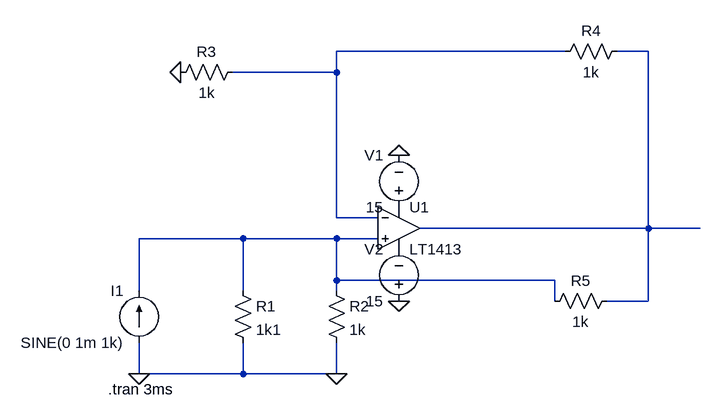
[diagram p0: schematic EXP-4_ItoV.asc]
EXP-4_ItoV.asc, the LTspice schematic file:
Version 4
SHEET 1 880 680
WIRE 480 -96 128 -96
WIRE 608 -96 560 -96
WIRE 128 -64 128 -96
WIRE 128 -64 -32 -64
WIRE 128 160 128 -64
WIRE 192 160 128 160
WIRE 608 176 608 -96
WIRE 608 176 256 176
WIRE 688 176 608 176
WIRE -16 192 -176 192
WIRE 128 192 -16 192
WIRE 192 192 128 192
WIRE 128 256 128 192
WIRE 464 256 128 256
WIRE -176 272 -176 192
WIRE -16 272 -16 192
WIRE 128 272 128 256
WIRE 464 288 464 256
WIRE 608 288 608 176
WIRE 608 288 544 288
WIRE -176 400 -176 352
WIRE -16 400 -16 352
WIRE -16 400 -176 400
WIRE 128 400 128 352
WIRE 128 400 -16 400
FLAG -176 400 0
FLAG 128 400 0
FLAG -112 -64 0
FLAG 224 64 0
FLAG 224 288 0
SYMBOL current -176 352 R180
WINDOW 0 24 80 Left 2
WINDOW 3 24 0 Left 2
WINDOW 123 0 0 Left 0
WINDOW 39 0 0 Left 0
SYMATTR InstName I1
SYMATTR Value SINE(0 1m 1k)
SYMBOL res -32 256 R0
SYMATTR InstName R1
SYMATTR Value 1k1
SYMBOL res 112 256 R0
SYMATTR InstName R2
SYMATTR Value 1k
SYMBOL res -16 -80 R90
WINDOW 0 0 56 VBottom 2
WINDOW 3 32 56 VTop 2
SYMATTR InstName R3
SYMATTR Value 1k
SYMBOL res 576 -112 R90
WINDOW 0 0 56 VBottom 2
WINDOW 3 32 56 VTop 2
SYMATTR InstName R4
SYMATTR Value 1k
SYMBOL res 560 272 R90
WINDOW 0 0 56 VBottom 2
WINDOW 3 32 56 VTop 2
SYMATTR InstName R5
SYMATTR Value 1k
SYMBOL OpAmps\\LT1413 224 112 R0
SYMATTR InstName U1
SYMBOL voltage 224 160 R180
WINDOW 0 24 96 Left 2
WINDOW 3 24 16 Left 2
WINDOW 123 0 0 Left 0
WINDOW 39 0 0 Left 0
SYMATTR InstName V1
SYMATTR Value 15
SYMBOL voltage 224 304 R180
WINDOW 0 24 96 Left 2
WINDOW 3 24 16 Left 2
WINDOW 123 0 0 Left 0
WINDOW 39 0 0 Left 0
SYMATTR InstName V2
SYMATTR Value 15
TEXT -224 424 Left 2 !.tran 3ms

The netlist it stands for:
* EXP-4_ItoV.asc
I1 0 N003 SINE(0 1m 1k)
R1 N003 0 1k1
R2 N003 0 1k
R3 N001 0 1k
R4 N002 N001 1k
R5 N002 N003 1k
XU1 N003 N001 P001 P002 N002 LT1413  ; pins In+ In- V+ V- OUT
V1 P001 0 15
V2 0 P002 15
.tran 3ms
.lib LTC.lib
.backanno
.end